# Altium schematic sheet Advanced_H_Bridge_schematics.SchDoc: Title
size A4; Date: 2012-11-00; ApprovedBy: Andrew Watson; CheckedBy: Andrew Watson; Author: Andrew Watson; CompanyName: Robopoly; DrawnBy: Andrew Watson; Engineer: Andrew Watson; Organization: Robopoly; DocumentNumber: Proj-0001; Revision: 0.1a; SheetNumber: 1; SheetTotal: 1; DrawnByDate: 2012-11-00; VerifiedByDate: 2012-11-00; VerifiedBy: Andrew Watson; License: CC-by-sa; DocumentName: DocName; ModifiedDate: 2012-11-00; ProjectName: ProjName
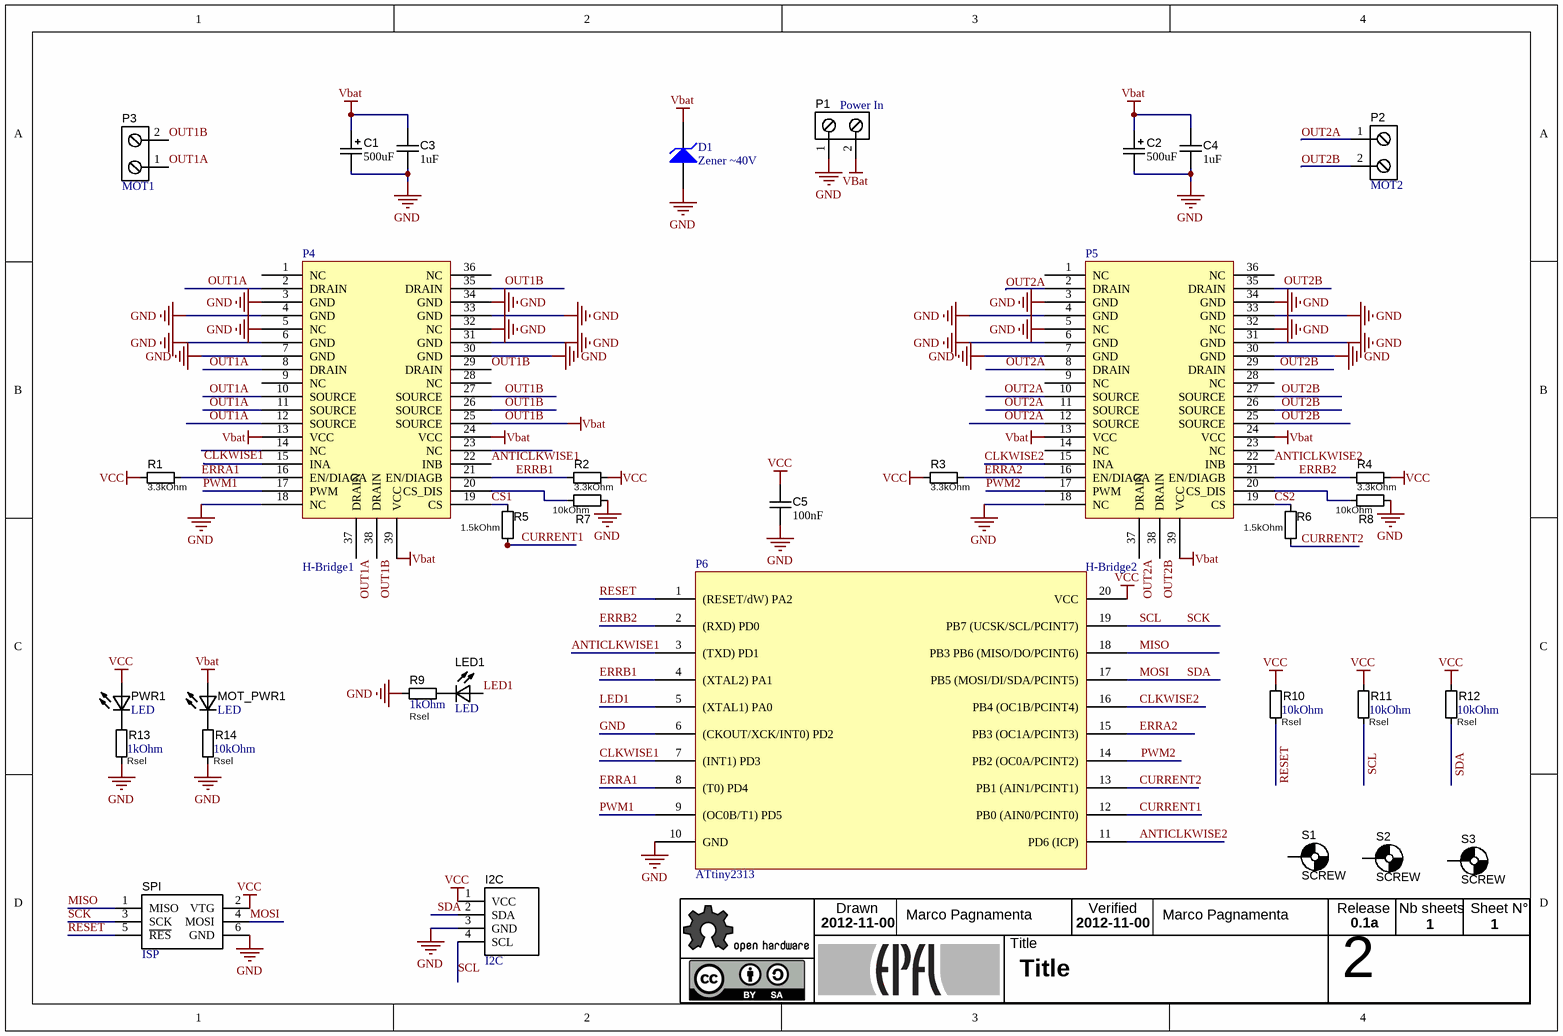
[diagram p0: Advanced_H_Bridge_schematics.SchDoc]

## Parts
C1  value 500uF  [C+/Rad-6x12mm]  (hidden comment: C Pol)
C2  value 500uF  [C+/Rad-6x12mm]  (hidden comment: C Pol)
C3  value 1uF  [C/0805]  (hidden comment: C)
C4  value 1uF  [C/0805]  (hidden comment: C)
C5  value 100nF  [C/0805]  (hidden comment: C)
D1  Zener ~40V  [DIODE-0.7]
I2C  I2C  [TYCO/215079-4]
LED1  LED  [LED-2012[0805]]
MOT_PWR1  LED  [LED-2012[0805]]
P1  Power In  [Phoenix PT 2-Pole]
P2  MOT2  [Phoenix PT 2-Pole]
P3  MOT1  [Phoenix PT 2-Pole]
P4  H-Bridge1  [VNH5180A-E]
P5  H-Bridge2  [VNH5180A-E]
P6  ATtiny2313  [ATtiny2313_SOIC_20S_new]
PWR1  LED  [LED-2012[0805]]
R1  3.3kOhm  [R/0805]
R2  3.3kOhm  [R/0805]
R3  3.3kOhm  [R/0805]
R4  3.3kOhm  [R/0805]
R5  1.5kOhm  [R/0805]
R6  1.5kOhm  [R/0805]
R7  10kOhm  [R/0805]
R8  10kOhm  [R/0805]
R9  1kOhm  value Rsel  [R/0805]
R10  10kOhm  value Rsel  [R/0805]
R11  10kOhm  value Rsel  [R/0805]
R12  10kOhm  value Rsel  [R/0805]
R13  1kOhm  value Rsel  [R/0805]
R14  10kOhm  value Rsel  [R/0805]
S1  SCREW  [HW/SCREW/M2_5]
S2  SCREW  [HW/SCREW/M2_5]
S3  SCREW  [HW/SCREW/M2_5]
SPI  ISP  [HEADER2X3]

## Nets
GND: C1.2 C2.2 C3.1 C4.1 C5.1 D1.1(A) I2C.3(GND) P1.1 P4.3(GND) P4.4(GND) P4.5(NC) P4.6(GND) P4.7(GND) P4.18(NC) P4.30(GND) P4.31(GND) P4.32(NC) P4.33(GND) P4.34(GND) P5.3(GND) P5.4(GND) P5.5(NC) P5.6(GND) P5.7(GND) P5.18(NC) P5.30(GND) P5.31(GND) P5.32(NC) P5.33(GND) P5.34(GND) P6.6((CKOUT/XCK/INT0)_PD2) P6.10(GND) R7.1 R8.1 R9.1 R13.1 R14.1 SPI.6(GND)
OUT1B: C1.1 C2.1 C3.2 C4.2 D1.2(K) MOT_PWR1.A P1.2 P3.2 P4.13(VCC) P4.24(VCC) P4.25(SOURCE) P4.26(SOURCE) P4.27(SOURCE) P4.29(DRAIN) P4.35(DRAIN) P4.38(DRAIN) P4.39(VCC) P5.13(VCC) P5.24(VCC) P5.39(VCC)  [also labelled Vbat]
VCC: C5.2 I2C.1(VCC) P6.20(VCC) PWR1.A R1.2 R2.1 R3.2 R4.1 R10.2 R11.2 R12.2 SPI.2(VTG)
ANTICLKWISE1: P4.22(INB) P6.3((TXD)_PD1)
ANTICLKWISE2: P5.22(INB) P6.11(PD6_(ICP))
CLKWISE1: P4.15(INA) P6.7((INT1)_PD3)
CLKWISE2: P5.15(INA) P6.16(PB4_(OC1B/PCINT4))
CS1: P4.19(CS) R5.2
CS2: P5.19(CS) R6.2
CURRENT1: P6.12(PB0_(AIN0/PCINT0)) R5.1
CURRENT2: P6.13(PB1_(AIN1/PCINT1)) R6.1
ERRA1: P4.16(EN/DIAGA) P6.8((T0)_PD4) R1.1
ERRA2: P5.16(EN/DIAGA) P6.15(PB3_(OC1A/PCINT3)) R3.1
ERRB1: P4.21(EN/DIAGB) P6.4((XTAL2)_PA1) R2.2
ERRB2: P5.21(EN/DIAGB) P6.2((RXD)_PD0) R4.2
LED1: LED1.A P6.5((XTAL1)_PA0)
MISO: P6.18(PB3_PB6_(MISO/DO/PCINT6)) SPI.1(MISO)
MOSI: I2C.2(SDA) P6.17(PB5_(MOSI/DI/SDA/PCINT5)) R12.1 SPI.4(MOSI)  [also labelled SDA]
OUT1A: P3.1 P4.2(DRAIN) P4.8(DRAIN) P4.10(SOURCE) P4.11(SOURCE) P4.12(SOURCE) P4.37(DRAIN)
OUT2A: P2.1 P5.2(DRAIN) P5.8(DRAIN) P5.10(SOURCE) P5.11(SOURCE) P5.12(SOURCE) P5.37(DRAIN)
OUT2B: P2.2 P5.25(SOURCE) P5.26(SOURCE) P5.27(SOURCE) P5.29(DRAIN) P5.35(DRAIN) P5.38(DRAIN)
PWM1: P4.17(PWM) P6.9((OC0B/T1)_PD5)
PWM2: P5.17(PWM) P6.14(PB2_(OC0A/PCINT2))
RESET: P6.1((RESET/dW)_PA2) R10.1 SPI.5(~{RES})
SCK: I2C.4(SCL) P6.19(PB7_(UCSK/SCL/PCINT7)) R11.1 SPI.3(SCK)  [also labelled SCL]
NetLED1_K: LED1.K R9.2
NetMOT_PWR1_K: MOT_PWR1.K R14.2
NetP4_20: P4.20(CS_DIS) R7.2
NetP5_20: P5.20(CS_DIS) R8.2
NetPWR1_K: PWR1.K R13.2

Not connected (* = marked no-connect by the designer): P4 1(NC) 9(NC) 14(NC) 23(NC) 28(NC) 36(NC); P5 1(NC) 9(NC) 14(NC) 23(NC) 28(NC) 36(NC); S1 1; S2 1; S3 1

## Notes on the sheet
- Drawn
- Marco Pagnamenta
- Verified
- Release
- Nb sheets
- (near S3) Sheet N°
- b
- a
- Title
- 2
- c
- by
- sa

## Library data of the parts
C1 C2 = C+/Rad: Polarized Capacitor (Radial); Published: 8-Jun-2000; LatestRevisionDate: 17-Jul-2002; LatestRevisionNote: Re-released for DXP Platform.; PackageReference: RB7.6-15; Publisher: Altium Limited
C3-C5 = C: Capacitor; Published: 8-Jun-2000; LatestRevisionDate: 17-Jul-2002; LatestRevisionNote: Re-released for DXP Platform.; PackageReference: RAD-0.3; Publisher: Altium Limited
D1 = D Zener: Zener Diode; Published: 8-Jun-2000; LatestRevisionDate: 17-Jul-2002; LatestRevisionNote: Re-released for DXP Platform.; PackageReference: DIODE-0.7; Publisher: Altium Limited; PackageDescription: Diode, Thru-Hole; 2 Leads; 0.7 in Pin Spacing
I2C = Micromatch-I2C: Micromatch I2C Connector
P1-P3 = Screw Block 2: 2-Pin Screw Terminal; LatestRevisionDate: 17-Jul-2002; LatestRevisionNote: Re-released for DXP Platform.; Publisher: Altium Limited
P4 P5 = VNH5180A-E: Header, 2-Pin; LatestRevisionDate: 17-Jul-2002; LatestRevisionNote: Re-released for DXP Platform.; Publisher: Altium Limited
P6 = ATtiny2313_SOIC_20S: Header, 2-Pin; LatestRevisionDate: 17-Jul-2002; LatestRevisionNote: Re-released for DXP Platform.; Publisher: Altium Limited
R1-R14 = R: Resistor; Published: 8-Jun-2000; LatestRevisionDate: 17-Jul-2002; LatestRevisionNote: Re-released for DXP Platform.; PackageReference: AXIAL-0.4; Publisher: Altium Limited
  R1-R4: Value: 3.3kOhm
  R5 R6: Value: 1.5kOhm
  R7 R8: Value: 10kOhm
SPI = AVR ISP 6pin: LatestRevisionDate: 17-Jul-2002; LatestRevisionNote: Re-released for DXP Platform.; Publisher: Altium Limited
LED1 MOT_PWR1 PWR1 = LED: Published: 8-Jun-2000; LatestRevisionDate: 08-Jul-2005; LatestRevisionNote: Mech Layer 1 removed.; PackageReference: LED-0; Publisher: Altium Limited